# EAGLE design M2k_HC4052_multiplexer_board (EAGLE 7.7.0)
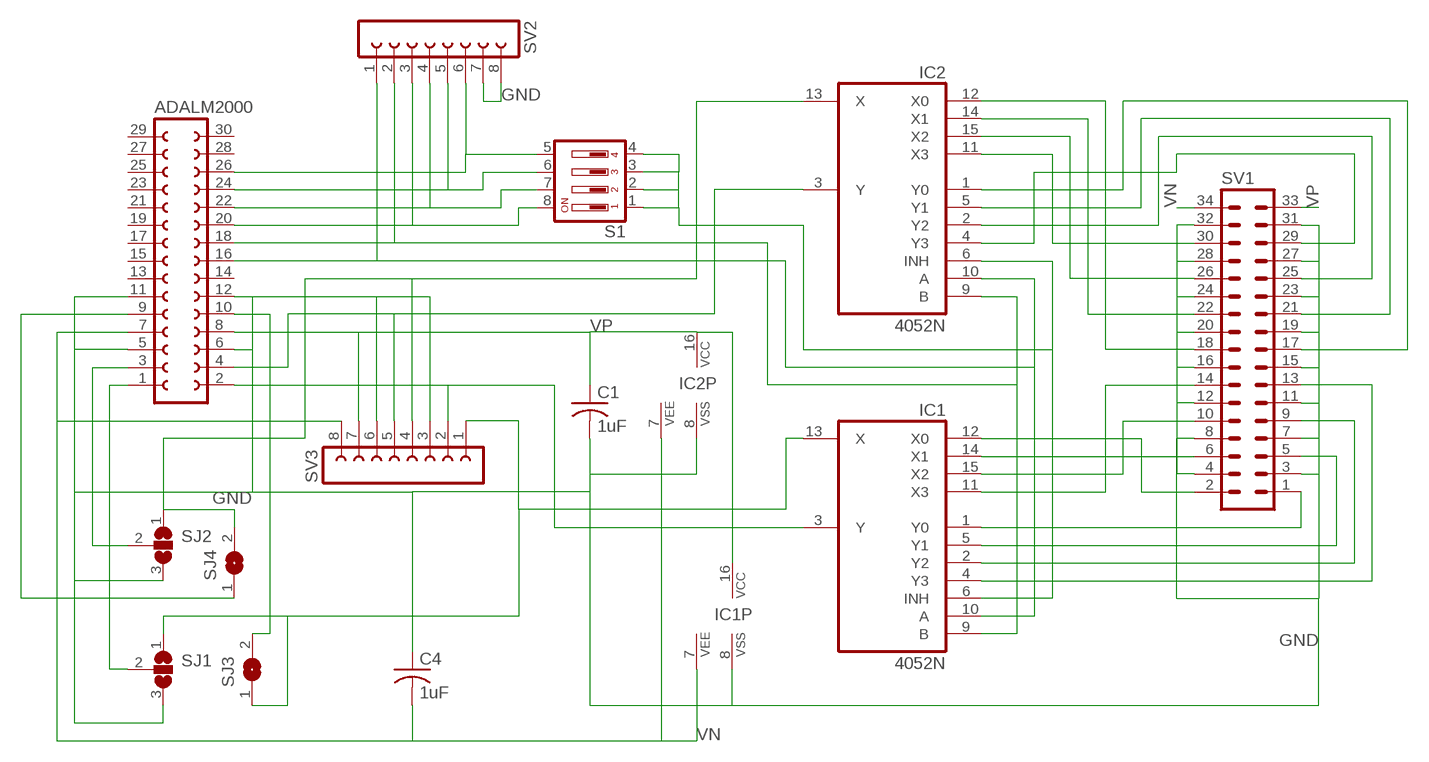
[diagram p0: schematic, sheet 1]

## Parts
ADALM2000  FE15-2  [FE15-2]
C1  1uF  C-US050-024X044  [C050-024X044]
C4  1uF  C-US050-024X044  [C050-024X044]
IC1  4052N  [DIL16]
IC2  4052N  [DIL16]
S1  DIP04YL  [DIP04YL]
SJ1  SJ2W  [SJ_2]
SJ2  SJ2W  [SJ_2]
SJ3  SJ  [SJ]
SJ4  SJ  [SJ]
SV1  MA17-2  [MA17-2]
SV2  FE08-1  [FE08]
SV3  FE08-1  [FE08]

## Nets
ES: IC1.13(X) SJ1.1 SJ3.1 SV3.1
GND: ADALM2000.5 ADALM2000.6 ADALM2000.11 ADALM2000.12 C1.2 C4.1 IC1.8(VSS) IC2.8(VSS) SJ1.3 SJ2.3 SV1.3 SV1.4 SV1.7 SV1.8 SV1.11 SV1.12 SV1.15 SV1.16 SV1.19 SV1.20 SV1.23 SV1.24 SV1.27 SV1.28 SV1.31 SV1.32 SV2.7 SV2.8 SV3.3 SV3.6
N$1: ADALM2000.26 S1.5 SV2.6
N$3: IC1.12(X0) SV1.2
N$4: IC1.6(INH) IC2.6(INH) S1.1 S1.2 S1.3 S1.4
N$5: ADALM2000.2 IC1.3(Y) SV3.2
N$6: IC1.1(Y0) SV1.1
N$7: IC1.14(X1) SV1.6
N$8: IC2.13(X) SJ2.1 SJ4.2 SV3.4
N$9: IC1.5(Y1) SV1.5
N$10: IC1.15(X2) SV1.10
N$11: ADALM2000.4 IC2.3(Y) SV3.5
N$12: ADALM2000.16 IC1.10(A) IC2.10(A) SV2.1
N$13: ADALM2000.18 IC1.9(B) IC2.9(B) SV2.2
N$14: IC1.11(X3) SV1.14
N$15: IC1.2(Y2) SV1.9
N$16: IC1.4(Y3) SV1.13
N$17: IC2.12(X0) SV1.18
N$18: IC2.14(X1) SV1.22
N$19: IC2.15(X2) SV1.26
N$20: IC2.11(X3) SV1.30
N$21: IC2.1(Y0) SV1.17
N$22: IC2.5(Y1) SV1.21
N$23: IC2.2(Y2) SV1.25
N$24: IC2.4(Y3) SV1.29
N$25: ADALM2000.1 SJ1.2
N$26: ADALM2000.3 SJ2.2
N$85: ADALM2000.20 S1.8 SV2.3
N$86: ADALM2000.22 S1.7 SV2.4
N$101: ADALM2000.24 S1.6 SV2.5
VN: ADALM2000.7 C4.2 IC1.7(VEE) IC2.7(VEE) SV1.34 SV3.8
VP: ADALM2000.8 C1.1 IC1.16(VCC) IC2.16(VCC) SV1.33 SV3.7
W1: ADALM2000.10 SJ3.2
W2: ADALM2000.9 SJ4.1
Unconnected: ADALM2000.13 ADALM2000.14 ADALM2000.15 ADALM2000.17 ADALM2000.19 ADALM2000.21 ADALM2000.23 ADALM2000.25 ADALM2000.27 ADALM2000.28 ADALM2000.29 ADALM2000.30

## Library data of the parts
ADALM2000 = con-lsta:FE15-2: FEMALE HEADER; OC_FARNELL: unknown; OC_NEWARK: unknown
C1 C4 = rcl:C-US: CAPACITOR, American symbol
IC1 IC2 = 40xx:4052: Dual 4-channel ANALOG MULTIPLEXER
S1 = switch-dil:DIP04YL: DIL/CODE SWITCH; OC_FARNELL: unknown; OC_NEWARK: unknown
SJ1 SJ2 = jumper:SJ2W: SMD solder JUMPER
SJ3 SJ4 = jumper:SJ: SMD solder JUMPER
SV1 = con-lstb:MA17-2: PIN HEADER; OC_FARNELL: unknown; OC_NEWARK: unknown
SV2 SV3 = con-lsta:FE08-1: FEMALE HEADER; OC_FARNELL: unknown; OC_NEWARK: unknown

## Board
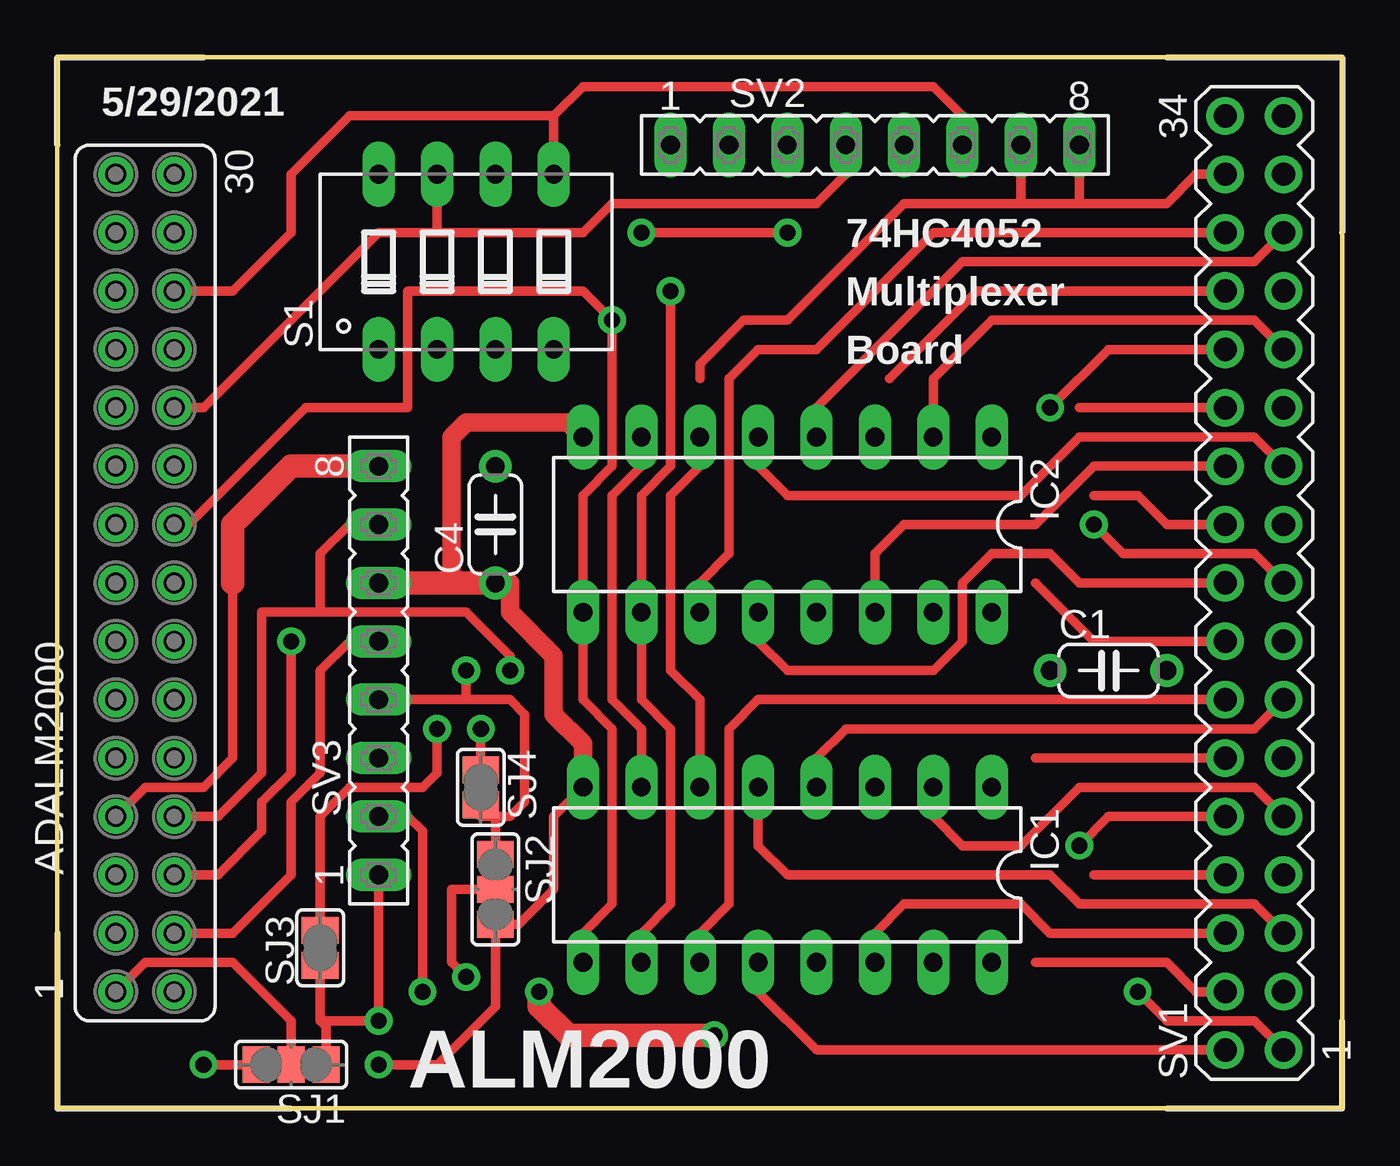
[diagram p1: board, top side]
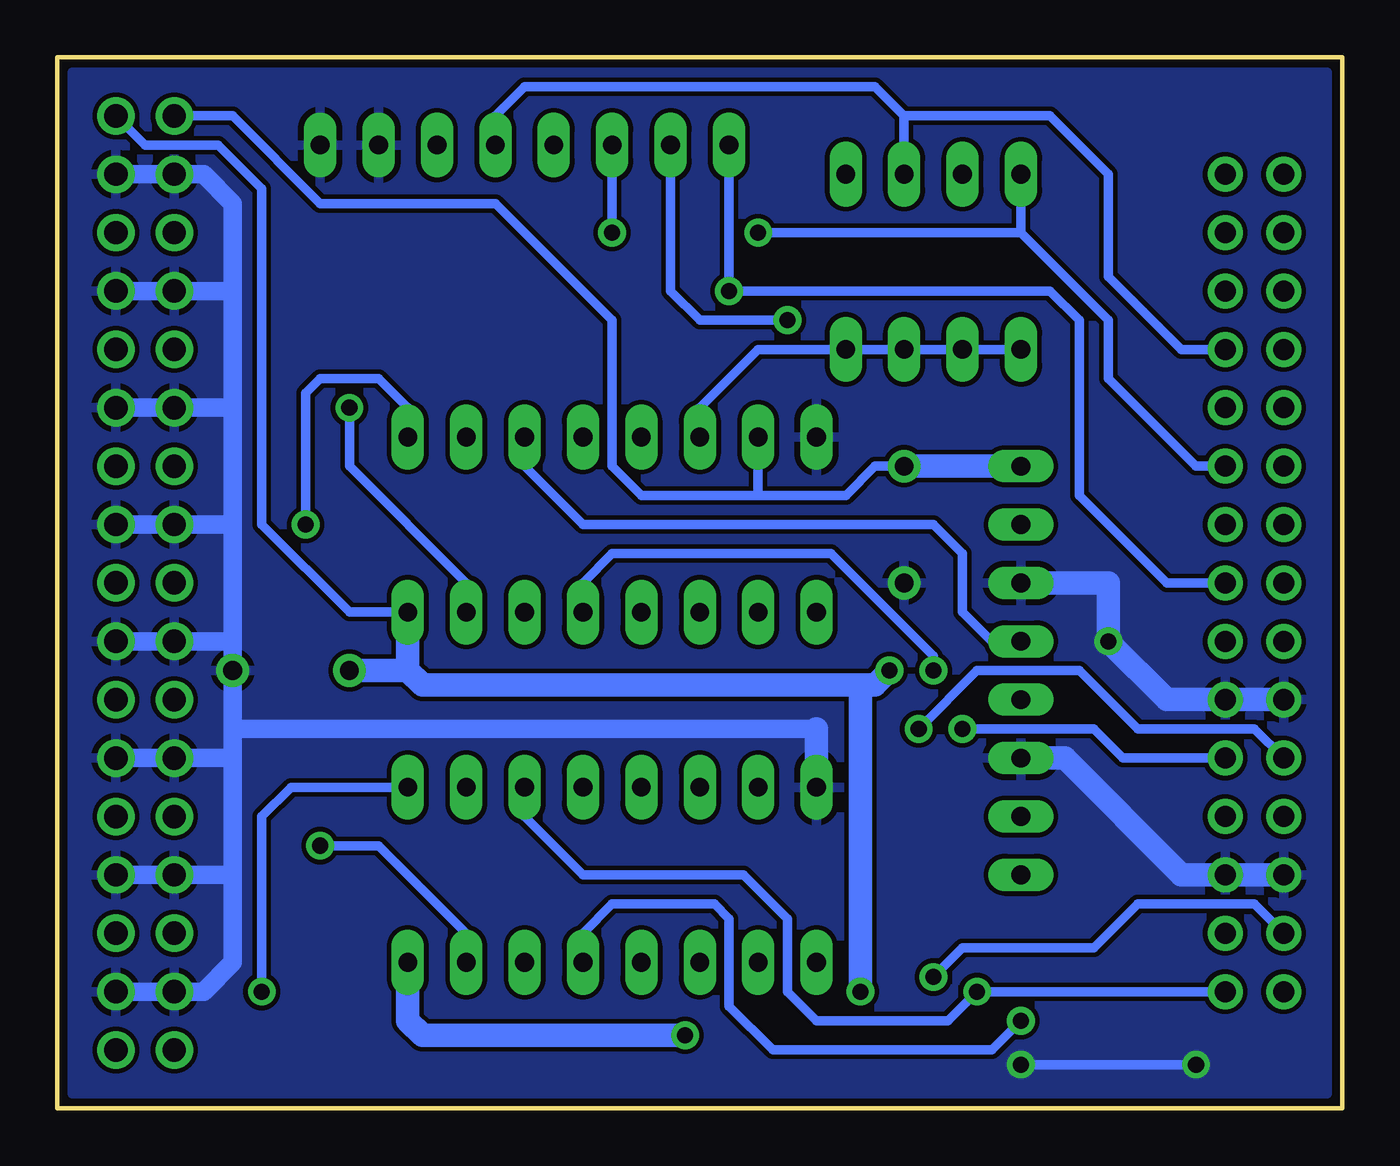
[diagram p2: board, bottom side, seen from below]

Size 55.88 x 45.72 mm. Coordinates in mm from the lower left corner, seen from the top.
Outline: 55.88,0 55.88,45.72 0,45.72 0,0 55.88,0
Copper layers (1*16): Top 0.035mm / dielectric 1.5mm / Bottom 0.035mm
Design rules "default": minimum track width 8mil, minimum drill 20mil, track to track 8mil, track to pad 8mil, pad to pad 8mil, via to via 8mil, smd to smd 8mil, copper to edge 8mil, drill to drill 8mil, minimum pad ring 12mil, minimum via ring 10mil, stop-mask expansion 4mil, vias tented up to drill 20mil, thermal gap 10mil

### Footprints (pad centres in the part's own frame; a part is rotated, then mirrored left to right if it is on the bottom)
FE15-2 = drill 0.914: 1 -17.78,1.27; 2 -17.78,-1.27; 3 -15.24,1.27; 4 -15.24,-1.27; 5 -12.7,1.27; 6 -12.7,-1.27; 7 -10.16,1.27; 8 -10.16,-1.27; 9 -7.62,1.27; 10 -7.62,-1.27; 11 -5.08,1.27; 12 -5.08,-1.27; 13 -2.54,1.27; 14 -2.54,-1.27; 15 0,1.27; 16 0,-1.27; 17 2.54,1.27; 18 2.54,-1.27; 19 5.08,1.27; 20 5.08,-1.27; 21 7.62,1.27; 22 7.62,-1.27; 23 10.16,1.27; 24 10.16,-1.27; 25 12.7,1.27; 26 12.7,-1.27; 27 15.24,1.27; 28 15.24,-1.27; 29 17.78,1.27; 30 17.78,-1.27
C050-024X044 = drill 0.813: 1 -2.54,0; 2 2.54,0
DIL16 = drill 0.813 long: 1 -8.89,-3.81; 2 -6.35,-3.81; 3 -3.81,-3.81; 4 -1.27,-3.81; 5 1.27,-3.81; 6 3.81,-3.81; 7 6.35,-3.81; 8 8.89,-3.81; 9 8.89,3.81; 10 6.35,3.81; 11 3.81,3.81; 12 1.27,3.81; 13 -1.27,3.81; 14 -3.81,3.81; 15 -6.35,3.81; 16 -8.89,3.81
DIP04YL = drill 0.813 long: 1 -3.81,-3.81; 2 -1.27,-3.81; 3 1.27,-3.81; 4 3.81,-3.81; 5 3.81,3.81; 6 1.27,3.81; 7 -1.27,3.81; 8 -3.81,3.81
SJ_2 = smd 1.168 x 1.6: 1 -1.524,0; 2 0,0; 3 1.524,0
SJ = smd 1.168 x 1.6: 1 -0.762,0; 2 0.762,0
MA17-2 = drill 1.016: 1 -20.32,-1.27; 2 -20.32,1.27; 3 -17.78,-1.27; 4 -17.78,1.27; 5 -15.24,-1.27; 6 -15.24,1.27; 7 -12.7,-1.27; 8 -12.7,1.27; 9 -10.16,-1.27; 10 -10.16,1.27; 11 -7.62,-1.27; 12 -7.62,1.27; 13 -5.08,-1.27; 14 -5.08,1.27; 15 -2.54,-1.27; 16 -2.54,1.27; 17 0,-1.27; 18 0,1.27; 19 2.54,-1.27; 20 2.54,1.27; 21 5.08,-1.27; 22 5.08,1.27; 23 7.62,-1.27; 24 7.62,1.27; 25 10.16,-1.27; 26 10.16,1.27; 27 12.7,-1.27; 28 12.7,1.27; 29 15.24,-1.27; 30 15.24,1.27; 31 17.78,-1.27; 32 17.78,1.27; 33 20.32,-1.27; 34 20.32,1.27
FE08 = drill 0.813 long: 1 -8.89,0; 2 -6.35,0; 3 -3.81,0; 4 -1.27,0; 5 1.27,0; 6 3.81,0; 7 6.35,0; 8 8.89,0

### Placement (x,y rotation side)
ADALM2000  3.81,22.86 90 top
C1  45.72,19.05 0 top
C4  19.05,25.4 90 top
IC1  31.75,10.16 180 top
IC2  31.75,25.4 180 top
S1  17.78,36.83 0 top
SJ1  10.16,1.91 180 top
SJ2  19.05,9.53 270 top
SJ3  11.43,6.99 90 top
SJ4  18.41,13.97 270 top
SV1  52.07,22.86 90 top
SV2  35.56,41.91 0 top
SV3  13.97,19.05 90 top

### Tracks (layer width: path | path; a pad name or v marks a point on that pad's centre or on a via)
ES  (via drill 0.7)
  Top 0.406: SV3.1 v13.97,3.81 11.43,3.81 | 11.43,3.81 SJ3.1 | SJ1.1 11.68,3.56 11.43,3.81
  Bottom 0.406: IC1.13 33.02,7.62 31.75,8.89 27.3,8.89 26.67,8.26 26.67,4.45 24.77,2.54 15.24,2.54 v13.97,3.81
GND  (via drill 0.7)
  Top 0.406: 45.09,26.67 46.99,26.67 48.26,25.4 SV1.20 | SV1.28 40.01,35.56 36.2,31.75 | SV1.16 45.09,20.32 42.55,22.86 | 42.55,15.24 SV1.12 | 45.09,10.16 SV1.8 | SV1.4 49.53,5.08 48.26,6.35 42.55,6.35 | SV1.24 44.45,30.48 | IC1.8 21.59,12.7 21.59,9.53 20.07,8 SJ2.3 19.05,4.45 16.51,1.91 v13.97,1.91 | SJ1.3 v6.35,1.91 | ADALM2000.6 6.99,10.16 8.89,12.06 8.89,13.34 10.16,14.61 v10.16,20.32 | SV2.7 41.91,39.37 | 41.91,39.37 44.45,39.37 | 44.45,39.37 48.26,39.37 49.53,40.64 SV1.32 | SV2.8 44.45,39.37 | 41.91,39.37 36.83,39.37 31.75,34.29 29.84,34.29 27.94,32.38 27.94,31.75
  Top 0.813: IC2.8 22.23,29.84 17.78,29.84 17.14,29.21 17.14,22.86 | IC1.8 22.86,15.88 21.59,17.14 21.59,19.68 19.68,21.59 19.68,22.86 C4.1
  Top 1.016: C4.1 17.14,22.86 SV3.6
  Bottom 0.406: v6.35,1.91 v13.97,1.91
  Bottom 0.813: SV1.3 SV1.4 49.53,5.08 48.26,6.35 48.26,10.16 | SV1.7 SV1.8 48.26,10.16 | SV1.11 SV1.12 48.26,15.24 | SV1.15 SV1.16 48.26,20.32 | SV1.19 SV1.20 48.26,25.4 | SV1.23 SV1.24 48.26,30.48 | SV1.27 SV1.28 48.26,35.56 | SV1.31 SV1.32 49.53,40.64 48.26,39.37 48.26,35.56 | 48.26,35.56 48.26,30.48 | 48.26,30.48 48.26,25.4 | 48.26,25.4 48.26,20.32 | 48.26,20.32 C1.2 48.26,16.51 | 48.26,16.51 48.26,15.24 | 48.26,15.24 48.26,10.16 | 48.26,16.51 22.86,16.51
  Bottom 1.016: ADALM2000.5 ADALM2000.6 6.99,10.16 12.06,15.24 SV3.3 | ADALM2000.11 ADALM2000.12 7.62,17.78 v10.16,20.32 10.16,22.86 SV3.6 | IC1.8 22.86,16.51
  pour Bottom: 0.64,45.09 0.64,0.64 55.24,0.64 55.24,45.09
N$1
  Top 0.406: ADALM2000.26 7.62,35.56 10.16,38.1 10.16,39.37 10.16,40.64 12.7,43.18 21.59,43.18 | 21.59,43.18 S1.5 | SV2.6 39.37,43.18 38.1,44.45 22.86,44.45 21.59,43.18
N$3
  Top 0.406: SV1.2 33.02,2.54 30.48,5.08 IC1.12
N$4
  Top 0.406: IC1.6 27.94,17.78 26.67,19.05 26.67,26.67 27.94,27.94 IC2.6
  Bottom 0.406: S1.1 S1.2 S1.3 S1.4 25.4,33.02 27.94,30.48 IC2.6
N$5  (via drill 0.7)
  Top 0.406: SV3.2 15.24,12.7 15.88,12.06 v15.88,5.08
  Bottom 0.406: ADALM2000.2 v15.88,5.08 17.14,3.81 22.86,3.81 24.13,5.08 24.13,8.26 26.04,10.16 33.02,10.16 35.56,12.7 IC1.3
N$6  (via drill 0.7)
  Top 0.406: SV1.1 52.07,3.81 48.26,3.81 v46.99,5.08
  Bottom 0.406: IC1.1 45.72,13.97 46.99,12.7 v46.99,5.08
N$7
  Top 0.406: SV1.6 43.18,7.62 41.91,8.89 36.83,8.89 35.56,7.62 IC1.14
N$8  (via drill 0.7)
  Top 0.406: 17.78,17.78 SV3.4 | 17.78,17.78 v17.78,19.05 | 17.78,17.78 19.68,17.78 20.32,17.14 20.32,13.34 19.68,12.7 19.05,12.7 | SJ4.2 18.41,12.7 19.05,12.7 | SJ2.1 19.05,12.7
  Bottom 0.406: IC2.13 33.02,22.86 31.75,24.13 22.23,24.13 17.78,19.68 v17.78,19.05
N$9
  Top 0.406: SV1.5 52.07,8.89 44.45,8.89 43.18,10.16 31.75,10.16 30.48,11.43 IC1.5
N$10  (via drill 0.7)
  Top 0.406: SV1.10 45.72,12.7 v44.45,11.43
  Bottom 0.406: IC1.15 38.1,7.62 41.91,11.43 v44.45,11.43
N$11
  Top 0.406: ADALM2000.4 7.62,7.62 10.16,10.16 10.16,13.34 11.43,14.61 11.43,19.05 12.7,20.32 SV3.5
  Bottom 0.406: IC2.3 35.56,27.94 33.02,25.4 17.78,25.4 16.51,24.13 16.51,21.59 15.24,20.32 SV3.5
N$12  (via drill 0.7)
  Top 0.406: IC1.10 25.4,7.62 26.67,8.89 26.67,16.51 25.4,17.78 IC2.10 25.4,26.67 26.67,27.94 v26.67,35.56
  Bottom 0.406: SV2.1 v26.67,35.56 12.7,35.56 11.43,34.29 11.43,27.94 11.43,26.67 7.62,22.86 ADALM2000.16
N$13  (via drill 0.7)
  Top 0.406: IC1.9 22.86,7.62 24.13,8.89 24.13,16.51 22.86,17.78 IC2.9 22.86,26.67 24.13,27.94 v24.13,34.29 22.86,35.56 15.24,35.56 15.24,30.48 10.79,30.48 5.71,25.4 ADALM2000.18
  Bottom 0.406: v24.13,34.29 27.94,34.29 29.21,35.56 SV2.2
N$14
  Top 0.406: SV1.14 30.48,17.78 29.21,16.51 29.21,8.89 27.94,7.62 IC1.11
N$15
  Top 0.406: SV1.9 52.07,13.97 44.45,13.97 41.91,11.43 39.37,11.43 38.1,12.7 IC1.2
N$16
  Top 0.406: SV1.13 52.07,16.51 34.29,16.51 33.02,15.24 IC1.4
N$17
  Top 0.406: SV1.18 44.45,22.86 43.18,24.13 40.64,24.13 39.37,22.86 39.37,20.32 38.1,19.05 31.75,19.05 30.48,20.32 IC2.12
N$18
  Top 0.406: SV1.22 45.09,27.94 42.55,25.4 36.83,25.4 35.56,24.13 IC2.14
N$19  (via drill 0.7)
  Top 0.406: v43.18,30.48 45.72,33.02 SV1.26
  Bottom 0.406: IC2.15 38.1,22.86 43.18,27.94 v43.18,30.48
N$20
  Top 0.406: SV1.30 38.1,38.1 33.02,33.02 30.48,33.02 29.21,31.75 29.21,24.13 27.94,22.86 IC2.11
N$21  (via drill 0.7)
  Top 0.406: SV1.17 52.07,24.13 46.35,24.13 v45.09,25.4
  Bottom 0.406: v45.09,25.4 45.09,31.11 44.45,31.75 41.91,31.75 40.64,30.48 IC2.1
N$22
  Top 0.406: SV1.21 52.07,29.21 44.45,29.21 41.91,26.67 31.75,26.67 30.48,27.94 IC2.5
N$23
  Top 0.406: SV1.25 52.07,34.29 40.64,34.29 38.1,31.75 IC2.2
N$24
  Top 0.406: SV1.29 52.07,36.83 39.37,36.83 33.02,30.48 IC2.4
N$25
  Top 0.406: ADALM2000.1 3.81,6.35 7.62,6.35 10.16,3.81 SJ1.2
N$26  (via drill 0.7)
  Top 0.406: v17.78,5.71 17.14,6.35 17.14,9.53 SJ2.2
  Bottom 0.406: ADALM2000.3 3.81,8.89 8.89,8.89 10.79,6.99 16.51,6.99 v17.78,5.71
N$85  (via drill 0.7)
  Top 0.406: v31.75,38.1 v25.4,38.1
  Bottom 0.406: ADALM2000.20 6.35,27.94 10.16,31.75 10.16,34.29 13.97,38.1 | S1.8 13.97,38.1 | 13.97,38.1 v25.4,38.1 | SV2.3 v31.75,38.1
N$86
  Top 0.406: ADALM2000.22 6.35,30.48 13.97,38.1 16.51,38.1 | 16.51,38.1 S1.7 | SV2.4 34.29,40.64 33.02,39.37 24.13,39.37 22.86,38.1 16.51,38.1
N$101
  Bottom 0.406: ADALM2000.24 6.99,33.02 10.16,36.2 10.16,40.64 12.7,43.18 19.05,43.18 | 19.05,43.18 S1.6 | SV2.5 36.83,43.18 35.56,44.45 20.32,44.45 19.05,43.18
VN
  Top 0.406: IC2.7 25.4,27.94 24.13,26.67 24.13,17.78 25.4,16.51 IC1.7 | ADALM2000.7 3.81,13.97 6.35,13.97 7.62,15.24 7.62,22.86
  Top 1.016: 7.62,22.86 7.62,25.4 10.16,27.94 SV3.8
  Bottom 0.406: C4.2 20.32,27.94 21.59,26.67 25.4,26.67 | 25.4,26.67 IC2.7 | 25.4,26.67 30.48,26.67 31.75,27.94 31.75,34.29 36.83,39.37 44.45,39.37 48.26,43.18 SV1.34
  Bottom 1.016: SV3.8 C4.2
VP  (via drill 0.7)
  Top 0.406: ADALM2000.8 6.99,12.7 8.89,14.61 8.89,21.59 11.43,21.59 | 11.43,21.59 11.43,24.13 12.7,25.4 SV3.7 | 11.43,21.59 17.78,21.59 19.68,19.68 v19.68,19.05
  Top 1.016: v28.57,3.17 22.23,3.17 20.95,4.45 v20.95,5.08
  Bottom 0.406: IC2.16 43.18,21.59 46.99,25.4 46.99,40.01 48.9,41.91 52.07,41.91 SV1.33
  Bottom 1.016: IC1.16 40.64,3.81 40.01,3.17 v28.57,3.17 | IC2.16 40.64,19.05 | 40.64,19.05 40.01,18.41 20.95,18.41 | v20.95,5.08 20.95,18.41 | v19.68,19.05 20.32,18.41 20.95,18.41 | C1.1 40.64,19.05
W1  (via drill 0.7)
  Top 0.406: v16.51,16.51 16.51,14.61 15.88,13.97 12.7,13.97 11.43,12.7 SJ3.2
  Bottom 0.406: ADALM2000.10 9.53,15.24 10.79,16.51 v16.51,16.51
W2  (via drill 0.7)
  Top 0.406: SJ4.1 v18.41,16.51
  Bottom 0.406: ADALM2000.9 3.81,16.51 8.89,16.51 11.43,19.05 15.88,19.05 v18.41,16.51

### Text on the board
tPlace: 5/29/2021 | 74HC4052 | Multiplexer | Board | ALM2000